# EAGLE design camera_adapter (EAGLE 7.5.0)
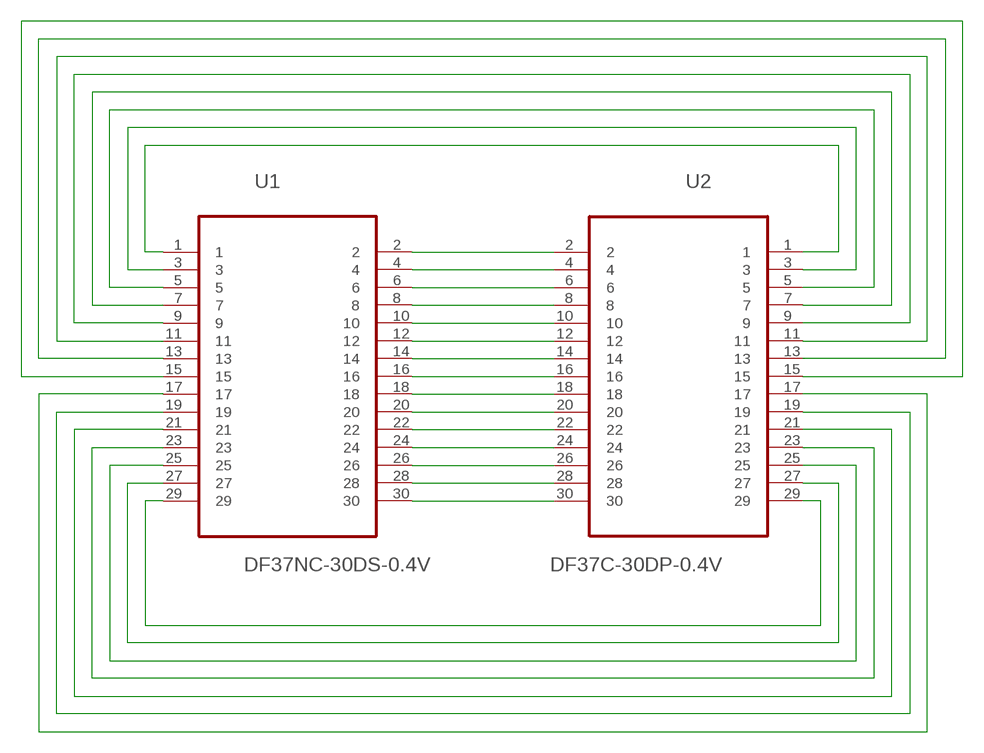
[diagram p0: schematic, sheet 1]

## Parts
U1  DF37NC-30DS-0.4V  DF37-30D-0.4V  [DF37**-30DS-0.4V]
U2  DF37C-30DP-0.4V  DF37-30D-0.4VHEADER  [DF37**-30DP-0.4V]

## Nets
N$1: U1.2 U2.2
N$2: U1.4 U2.4
N$3: U1.6 U2.6
N$4: U1.8 U2.8
N$5: U1.10 U2.10
N$6: U1.12 U2.12
N$7: U1.14 U2.14
N$8: U1.16 U2.16
N$9: U1.18 U2.18
N$10: U1.20 U2.20
N$11: U1.22 U2.22
N$12: U1.24 U2.24
N$13: U1.26 U2.26
N$14: U1.28 U2.28
N$15: U1.30 U2.30
N$16: U1.1 U2.1
N$17: U1.3 U2.3
N$18: U1.5 U2.5
N$19: U1.7 U2.7
N$20: U1.9 U2.9
N$21: U1.11 U2.11
N$22: U1.13 U2.13
N$23: U1.15 U2.15
N$24: U1.29 U2.29
N$25: U1.27 U2.27
N$26: U1.25 U2.25
N$27: U1.23 U2.23
N$28: U1.21 U2.21
N$29: U1.19 U2.19
N$30: U1.17 U2.17

## Library data of the parts
U1 = openblw:DF37**-30D*-0.4V: PLUG, 1MM, 41WAY; MPN: DF9-41P-1V(32); OC_FARNELL: 1798383; OC_NEWARK: 74R3384; PACKAGE: PLUG, 1MM, 41WAY; SUPPLIER: Hirose
U2 = openblw:DF37**-30D*-0.4V: PLUG, 1MM, 41WAY

## Board
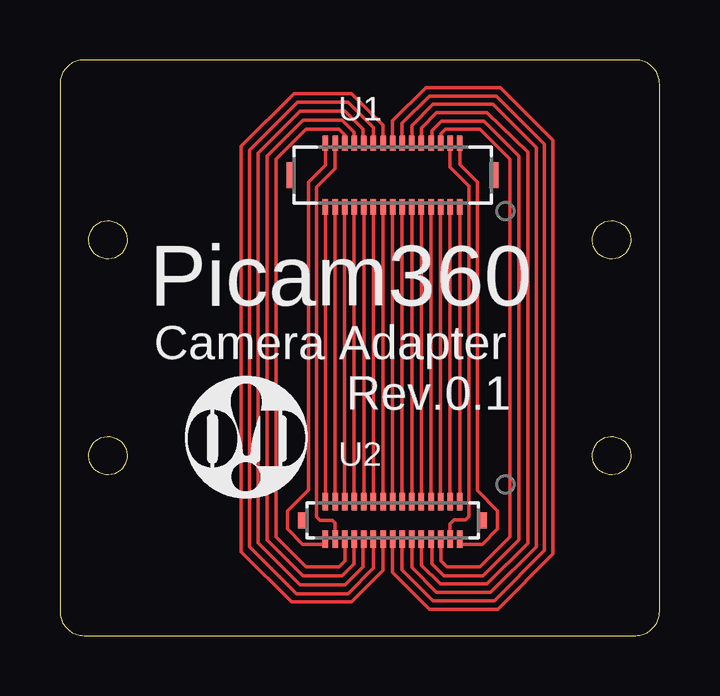
[diagram p1: board, top side]
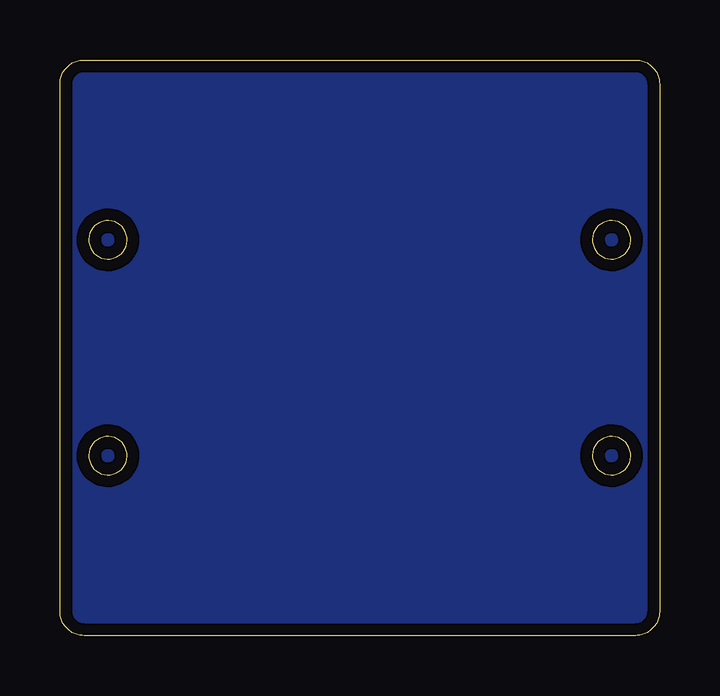
[diagram p2: board, bottom side, seen from below]

Size 25 x 24 mm. Coordinates in mm from the lower left corner, seen from the top.
Outline: 24.06,0 24.12,0.01 24.19,0.02 24.25,0.03 24.31,0.05 24.37,0.07 24.43,0.1 24.48,0.12 24.54,0.16 24.59,0.19 24.64,0.23 24.68,0.27 24.73,0.32 24.77,0.36 24.81,0.41 24.84,0.46 24.88,0.52 24.91,0.57 24.93,0.63 24.95,0.69 24.97,0.75 24.98,0.81 24.99,0.88 25,0.94 25,1 25,23 25,23.06 24.99,23.12 24.98,23.19 24.97,23.25 24.95,23.31 24.93,23.37 24.91,23.43 24.88,23.48 24.84,23.54 24.81,23.59 24.77,23.64 24.73,23.68 24.68,23.73 24.64,23.77 24.59,23.81 24.54,23.84 24.48,23.88 24.43,23.91 24.37,23.93 24.31,23.95 24.25,23.97 24.19,23.98 24.12,23.99 24.06,24 24,24 1,24 0.94,24 0.88,23.99 0.81,23.98 0.75,23.97 0.69,23.95 0.63,23.93 0.57,23.91 0.52,23.88 0.46,23.84 0.41,23.81 0.36,23.77 0.32,23.73 0.27,23.68 0.23,23.64 0.19,23.59 0.16,23.54 0.12,23.48 0.1,23.43 0.07,23.37 0.05,23.31 0.03,23.25 0.02,23.19 0.01,23.12 0,23.06 0,23 0,1 0,0.94 0.01,0.88 0.02,0.81 0.03,0.75 0.05,0.69 0.07,0.63 0.1,0.57 0.12,0.52 0.16,0.46 0.19,0.41 0.23,0.36 0.27,0.32 0.32,0.27 0.36,0.23 0.41,0.19 0.46,0.16 0.52,0.12 0.57,0.1 0.63,0.07 0.69,0.05 0.75,0.03 0.81,0.02 0.88,0.01 0.94,0 1,0 24,0 24.06,0
Outline: 22.9,15.71 22.78,15.73 22.66,15.78 22.55,15.84 22.45,15.91 22.37,16.01 22.3,16.11 22.25,16.23 22.21,16.35 22.2,16.47 22.21,16.6 22.23,16.72 22.27,16.84 22.34,16.95 22.41,17.05 22.51,17.13 22.61,17.2 22.73,17.25 22.85,17.29 22.97,17.3 23.1,17.29 23.22,17.27 23.34,17.23 23.45,17.16 23.55,17.09 23.63,16.99 23.7,16.89 23.75,16.77 23.79,16.65 23.8,16.53 23.79,16.4 23.77,16.28 23.73,16.16 23.66,16.05 23.59,15.95 23.49,15.87 23.39,15.8 23.27,15.75 23.15,15.71 23.03,15.7 22.9,15.71
Outline: 1.9,15.71 1.78,15.73 1.66,15.78 1.55,15.84 1.45,15.91 1.37,16.01 1.3,16.11 1.25,16.23 1.22,16.35 1.2,16.47 1.21,16.6 1.23,16.72 1.27,16.84 1.34,16.95 1.42,17.05 1.51,17.13 1.61,17.2 1.73,17.25 1.85,17.29 1.97,17.3 2.1,17.29 2.22,17.27 2.34,17.23 2.45,17.16 2.55,17.09 2.63,16.99 2.7,16.89 2.75,16.77 2.79,16.65 2.8,16.53 2.79,16.4 2.77,16.28 2.73,16.16 2.66,16.05 2.58,15.95 2.49,15.87 2.39,15.8 2.27,15.75 2.15,15.71 2.03,15.7 1.9,15.71
Outline: 22.9,6.71 22.78,6.73 22.66,6.78 22.55,6.84 22.45,6.92 22.37,7.01 22.3,7.11 22.25,7.23 22.21,7.35 22.2,7.47 22.21,7.6 22.23,7.72 22.27,7.84 22.34,7.95 22.41,8.05 22.51,8.13 22.61,8.2 22.73,8.25 22.85,8.29 22.97,8.3 23.1,8.29 23.22,8.27 23.34,8.22 23.45,8.16 23.55,8.09 23.63,7.99 23.7,7.89 23.75,7.77 23.79,7.65 23.8,7.53 23.79,7.4 23.77,7.28 23.73,7.16 23.66,7.05 23.59,6.95 23.49,6.87 23.39,6.8 23.27,6.75 23.15,6.71 23.03,6.7 22.9,6.71
Outline: 1.9,6.71 1.78,6.73 1.66,6.78 1.55,6.84 1.45,6.92 1.37,7.01 1.3,7.11 1.25,7.23 1.22,7.35 1.2,7.47 1.21,7.6 1.23,7.72 1.27,7.84 1.34,7.95 1.42,8.05 1.51,8.13 1.61,8.2 1.73,8.25 1.85,8.29 1.97,8.3 2.1,8.29 2.22,8.27 2.34,8.22 2.45,8.16 2.55,8.09 2.63,7.99 2.7,7.89 2.75,7.77 2.79,7.65 2.8,7.53 2.79,7.4 2.77,7.28 2.73,7.16 2.66,7.05 2.58,6.95 2.49,6.87 2.39,6.8 2.27,6.75 2.15,6.71 2.03,6.7 1.9,6.71
Copper layers (1*16): Top 0.035mm / dielectric 1.6mm / Bottom 0.035mm
Design rules "Elecrow_2-layer_PCB_eagle_rule": minimum track width 6mil, minimum drill 12mil, track to track 6mil, track to pad 6mil, pad to pad 6mil, via to via 8mil, smd to smd 0mil, copper to edge 20mil, drill to drill 10mil, minimum pad ring 6mil, minimum via ring 6mil, stop-mask expansion 0mil, vias tented up to drill 100mil, thermal gap 10mil

### Footprints (pad centres in the part's own frame; a part is rotated, then mirrored left to right if it is on the bottom)
DF37**-30DS-0.4V = smd 0.23 x 0.63: 1 2.8,-1.325; 2 2.8,1.325; 3 2.4,-1.325; 4 2.4,1.325; 5 2,-1.325; 6 2,1.325; 7 1.6,-1.325; 8 1.6,1.325; 9 1.2,-1.325; 10 1.2,1.325; 11 0.8,-1.325; 12 0.8,1.325; 13 0.4,-1.325; 14 0.4,1.325; 15 0,-1.325; 16 0,1.325; 17 -0.4,-1.325; 18 -0.4,1.325; 19 -0.8,-1.325; 20 -0.8,1.325; 21 -1.2,-1.325; 22 -1.2,1.325; 23 -1.6,-1.325; 24 -1.6,1.325; 25 -2,-1.325; 26 -2,1.325; 27 -2.4,-1.325; 28 -2.4,1.325; 29 -2.8,-1.325; 30 -2.8,1.325 | smd 0.38 x 1.1: 44 -4.23,0; 45 4.23,0
DF37**-30DP-0.4V = smd 0.23 x 0.73: 1 2.8,0.775; 2 2.8,-0.775; 3 2.4,0.775; 4 2.4,-0.775; 5 2,0.775; 6 2,-0.775; 7 1.6,0.775; 8 1.6,-0.775; 9 1.2,0.775; 10 1.2,-0.775; 11 0.8,0.775; 12 0.8,-0.775; 13 0.4,0.775; 14 0.4,-0.775; 15 0,0.775; 16 0,-0.775; 17 -0.4,0.775; 18 -0.4,-0.775; 19 -0.8,0.775; 20 -0.8,-0.775; 21 -1.2,0.775; 22 -1.2,-0.775; 23 -1.6,0.775; 24 -1.6,-0.775; 25 -2,0.775; 26 -2,-0.775; 27 -2.4,0.775; 28 -2.4,-0.775; 29 -2.8,0.775; 30 -2.8,-0.775 | smd 0.38 x 0.68: 44 -3.75,0; 45 3.75,0

### Placement (x,y rotation side)
LOGO1  [OHMYDIGIFAB_LOGO]  7.78,8.22 0 top
U1  13.87,19.2 0 top
U2  13.87,4.8 0 top

### Tracks (layer width: path | path; a pad name or v marks a point on that pad's centre or on a via)
N$1
  Top 0.152: U1.2 16.67,19.64 17.41,18.9 17.41,6.05 18.25,5.21 18.25,4.45 17.61,3.81 16.73,3.81 U2.2
N$2
  Top 0.152: 16.25,4.14 U2.4 16.27,4.66 16.43,4.83 16.9,4.83 17.05,4.98 17.05,18.75 16.27,19.54 U1.4
N$3
  Top 0.152: U2.6 15.88,3.76 15.88,3.12 16.13,2.88 17.5,2.88 18.75,4.12 18.75,19.88 17.5,21.12 16.08,21.12 15.88,20.93 15.88,20.62 U1.6
N$4
  Top 0.152: U2.8 15.51,3.88 15.51,3 16,2.5 17.63,2.5 19.13,4 19.13,20 17.68,21.45 15.9,21.45 15.51,21.05 15.51,20.62 U1.8
N$5
  Top 0.152: U2.10 15.07,2.94 15.86,2.15 17.8,2.15 19.5,3.85 19.5,20.15 17.8,21.8 15.71,21.8 15.07,21.16 U1.10
N$6
  Top 0.152: U2.12 14.67,2.83 15.71,1.8 17.95,1.8 19.86,3.7 19.86,20.35 18.05,22.15 15.55,22.15 14.67,21.27 U1.12
N$7
  Top 0.152: U1.14 14.27,21.36 15.4,22.5 18.2,22.5 20.2,20.5 20.2,3.55 18.11,1.45 15.55,1.45 14.27,2.73 U2.14
N$8
  Top 0.152: U2.16 13.87,2.63 15.4,1.1 18.25,1.1 20.55,3.4 20.55,20.65 18.36,22.85 15.26,22.85 13.87,21.46 U1.16
N$9
  Top 0.152: U2.18 13.47,2.71 12.15,1.4 9.65,1.4 7.55,3.5 7.55,20.4 9.76,22.6 12.15,22.6 13.47,21.29 U1.18
N$10
  Top 0.152: U2.20 13.07,2.81 12.01,1.75 9.86,1.75 7.91,3.7 7.91,20.25 9.9,22.25 12.01,22.25 13.07,21.18 U1.20
N$11
  Top 0.152: U2.22 12.63,3.88 12.63,2.88 11.88,2.12 10.01,2.12 8.26,3.88 8.26,20.12 10.01,21.88 11.88,21.88 12.63,21.12 12.63,20.62 U1.22
N$12
  Top 0.152: U2.24 12.26,3.76 12.26,3 11.76,2.5 10.13,2.5 8.63,4 8.63,20 10.13,21.5 11.76,21.5 12.26,21 12.26,20.62 U1.24
N$13
  Top 0.152: U2.26 11.88,3.88 11.88,3.12 11.63,2.88 10.26,2.88 9.01,4.12 9.01,19.88 10.26,21.12 11.63,21.12 11.88,20.88 11.88,20.62 U1.26
N$14
  Top 0.152: U1.28 11.47,19.46 10.71,18.7 10.71,4.94 10.84,4.81 11.36,4.81 11.46,4.7 U2.28
N$15
  Top 0.152: U1.30 11.07,19.61 10.36,18.9 10.36,6.08 9.49,5.21 9.49,4.45 10.12,3.81 11.01,3.81 U2.30
N$16
  Top 0.152: U1.1 U2.1
N$17
  Top 0.152: U1.3 U2.3
N$18
  Top 0.152: U1.5 U2.5
N$19
  Top 0.152: U1.7 U2.7
N$20
  Top 0.152: U1.9 U2.9
N$21
  Top 0.152: U1.11 U2.11
N$22
  Top 0.152: U1.13 U2.13
N$23
  Top 0.152: U1.15 U2.15
N$24
  Top 0.152: U1.29 U2.29
N$25
  Top 0.152: U1.27 U2.27
N$26
  Top 0.152: U1.25 U2.25
N$27
  Top 0.152: U1.23 U2.23
N$28
  Top 0.152: U1.21 U2.21
N$29
  Top 0.152: U1.19 U2.19
N$30
  Top 0.152: U1.17 U2.17
N$31
  pour Bottom: 0,24 24.97,24 24.97,0 0,0

### Text on the board
tPlace: Picam360 | Camera Adapter | Rev.0.1